# EAGLE design pcb-pick-plaz-ring (EAGLE 9.6.2)
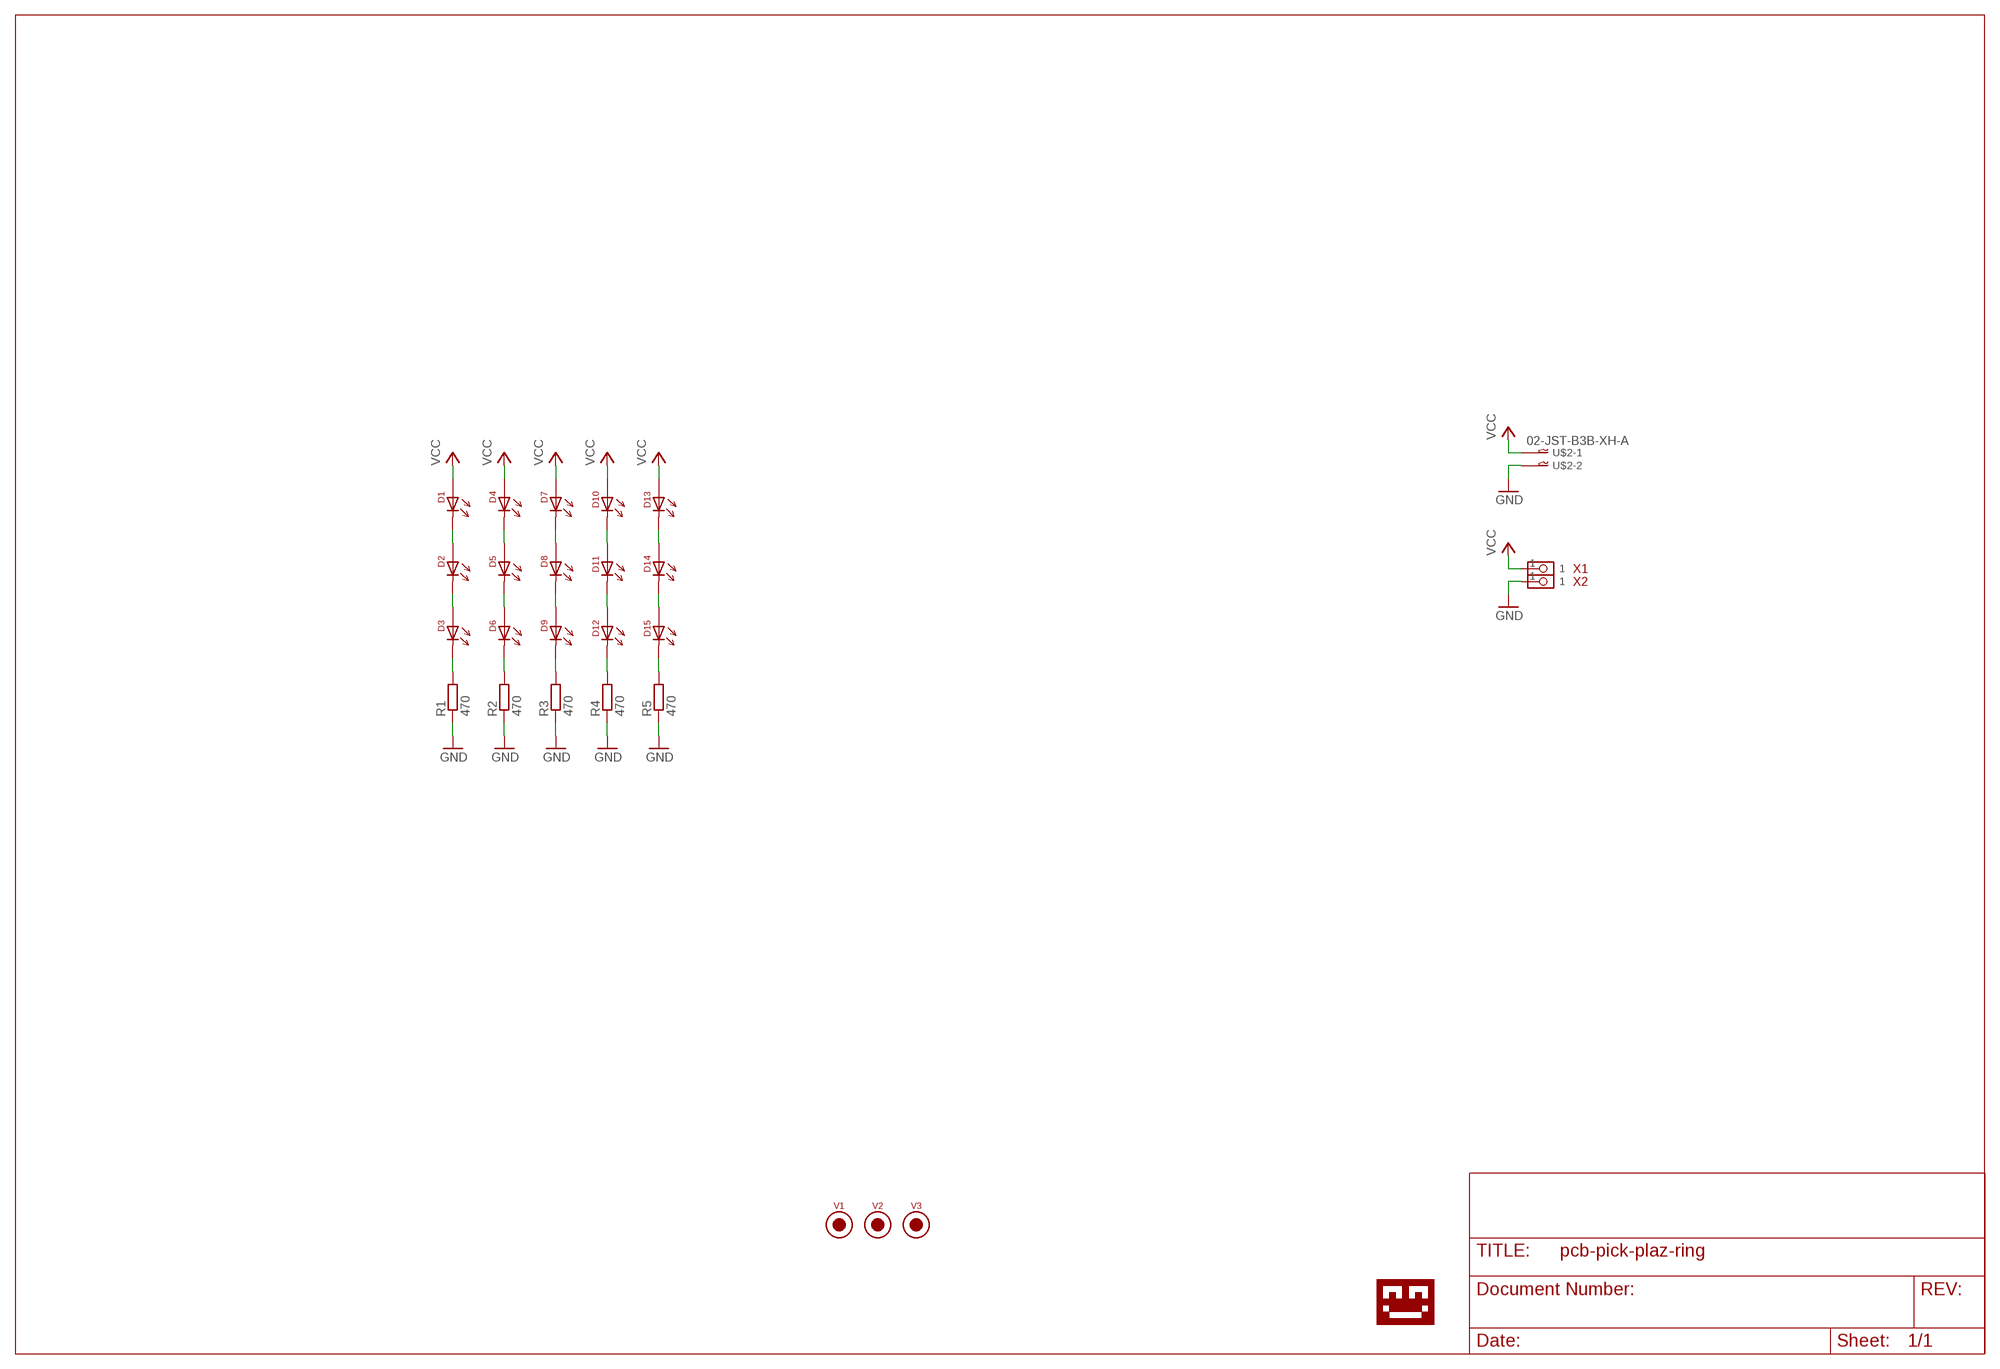
[diagram p0: schematic, sheet 1]

## Parts
D1  LED-5730  [5730-LED]
D2  LED-5730  [5730-LED]
D3  LED-5730  [5730-LED]
D4  LED-5730  [5730-LED]
D5  LED-5730  [5730-LED]
D6  LED-5730  [5730-LED]
D7  LED-5730  [5730-LED]
D8  LED-5730  [5730-LED]
D9  LED-5730  [5730-LED]
D10  LED-5730  [5730-LED]
D11  LED-5730  [5730-LED]
D12  LED-5730  [5730-LED]
D13  LED-5730  [5730-LED]
D14  LED-5730  [5730-LED]
D15  LED-5730  [5730-LED]
R1  470  RESISTOR0805_RES  [0805_RES]
R2  470  RESISTOR0805_RES  [0805_RES]
R3  470  RESISTOR0805_RES  [0805_RES]
R4  470  RESISTOR0805_RES  [0805_RES]
R5  470  RESISTOR0805_RES  [0805_RES]
U$1  LOGO-TOBENG-1MM-FINISH  [TOBENG-1MM-FINISH]
U$2  02-JST-B3B-XH-A  [B2B-XH]
V1  FIDUCIAL2MM  [FIDUCIAL_2MM]
V2  FIDUCIAL2MM  [FIDUCIAL_2MM]
V3  FIDUCIAL2MM  [FIDUCIAL_2MM]
X1  PIN_1X1SMD_BIG_L  [PIN_1X1_SMD_BIG_L]
X2  PIN_1X1SMD_BIG_L  [PIN_1X1_SMD_BIG_L]

## Nets
GND: R1.1 R2.1 R3.1 R4.1 R5.1 U$2.P$2 X2.1
N$1: D1.C D2.A1 D2.A2
N$2: D2.C D3.A1 D3.A2
N$3: D3.C R1.2
N$4: D4.C D5.A1 D5.A2
N$5: D5.C D6.A1 D6.A2
N$6: D6.C R2.2
N$7: D7.C D8.A1 D8.A2
N$8: D8.C D9.A1 D9.A2
N$9: D9.C R3.2
N$10: D10.C D11.A1 D11.A2
N$11: D11.C D12.A1 D12.A2
N$12: D12.C R4.2
N$13: D13.C D14.A1 D14.A2
N$14: D14.C D15.A1 D15.A2
N$15: D15.C R5.2
VCC: D1.A1 D1.A2 D4.A1 D4.A2 D7.A1 D7.A2 D10.A1 D10.A2 D13.A1 D13.A2 U$2.P$1 X1.1

## Library data of the parts
D1-D15 = ftobler:LED
R1-R5 = passives:RESISTOR: Resistor Basic schematic elements and footprints for 0201, 0402, 0603, 1206, and PTH resistors.
U$1 = ftobler:LOGO
U$2 = bt_con-jst-xh:02-JST: JST CONNECTOR
V1-V3 = ftobler:FIDUCIAL
X1 X2 = ftobler-conn:PIN_1X1

## Board
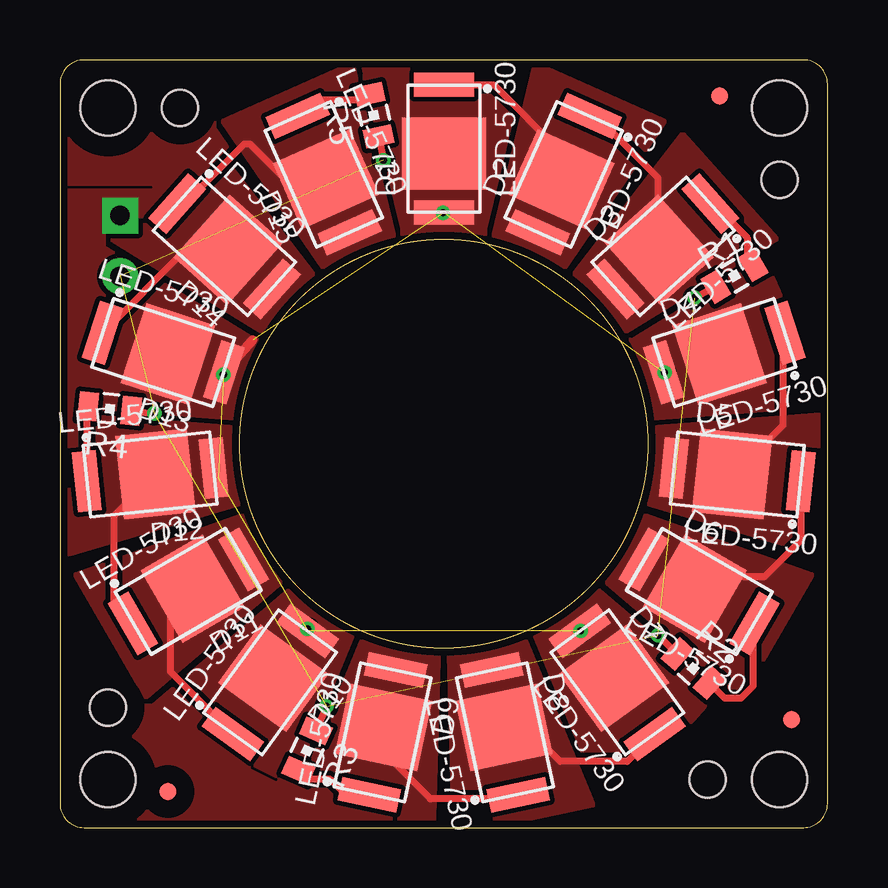
[diagram p1: board, top side]
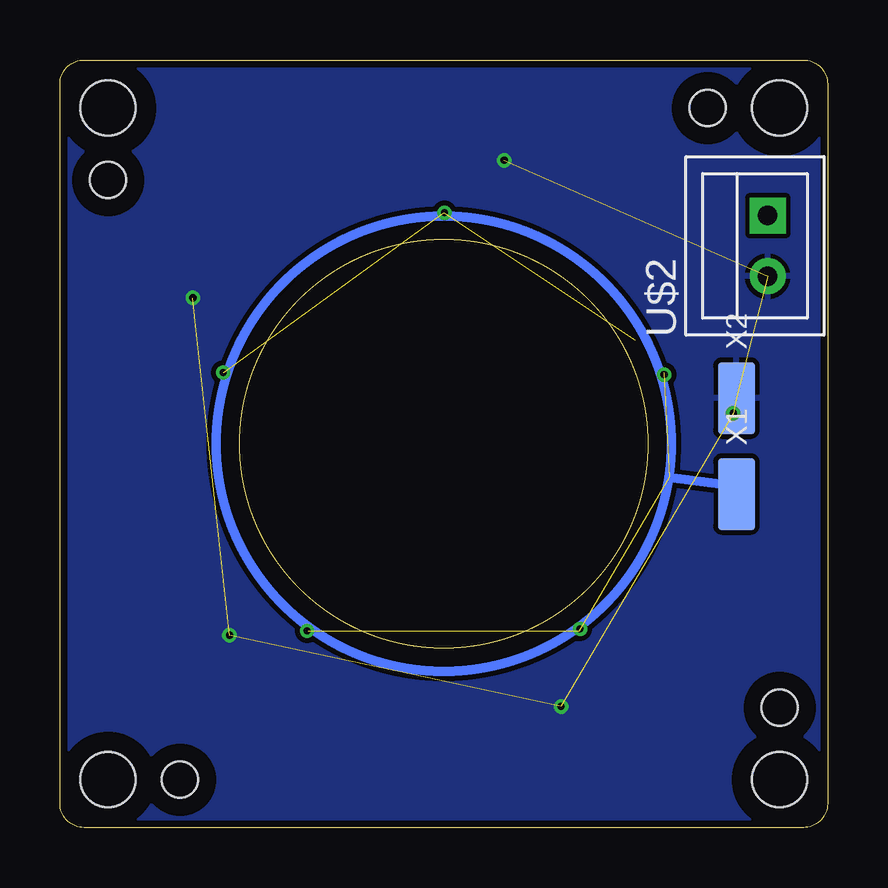
[diagram p2: board, bottom side, seen from below]

Size 32 x 32 mm. Coordinates in mm from the lower left corner, seen from the top.
Outline: 0,31 0,1 arc90 1,0 31,0 arc90 32,1 32,31 arc90 31,32 1,32 arc90 0,31
Outline: circle at 16,16 radius 8.5
Copper layers (1*16): Top 0.035mm / dielectric 1.5mm / Bottom 0.035mm
Design rules "default *": minimum track width 0.2mm, minimum drill 0.3mm, track to track 0.2mm, track to pad 0.2mm, pad to pad 0.2mm, via to via 0.2mm, smd to smd 0.2mm, copper to edge 0.3mm, drill to drill 10mil, minimum pad ring 0.15mm, minimum via ring 0.15mm, stop-mask expansion 0.05mm, vias tented up to drill 0.35mm, thermal gap 0.2mm
Holes 2.3 mm at 2,2 30,30 30,2 2,30
Holes 1.5 mm at 5,30 30,27 27,2 2,5
tRestrict: area 0,28 to 4,32; area 3.5,28.5 to 6.5,31.5; area 28.5,25.5 to 31.5,28.5; area 28,28 to 32,32; area 25.5,0.5 to 28.5,3.5; area 0.5,3.5 to 3.5,6.5; area 0,0 to 4,4; area 28,0 to 32,4; 4 lines
bRestrict: area 0,28 to 4,32; area 28,28 to 32,32; area 0,0 to 4,4; area 28,0 to 32,4; area 3.5,28.5 to 6.5,31.5; area 28.5,25.5 to 31.5,28.5; area 0.5,3.5 to 3.5,6.5; area 25.5,0.5 to 28.5,3.5

### Footprints (pad centres in the part's own frame; a part is rotated, then mirrored left to right if it is on the bottom)
5730-LED = smd 1 x 2.5: A1 -2.66,0; C 2.66,0 | smd 3 x 3.5: A2 -0.215,0
0805_RES = smd 0.8 x 1.2: 1 -0.9,0; 2 0.9,0
B2B-XH = drill 0.8 pad 1.5 square: P$1 1.27,0 | drill 0.8 pad 1.5: P$2 -1.27,0
FIDUCIAL_2MM = smd 0.7 x 0.7: V 0,0
PIN_1X1_SMD_BIG_L = smd 3 x 1.54: 1 0,0

### Placement (x,y rotation side)
D1  16,28.3 90 top
D2  21,27.24 66 top
D3  25.14,24.23 42 top
D4  27.7,19.8 18 top
D5  28.23,14.71 354 top
D6  26.65,9.85 330 top
D7  23.23,6.05 306 top
D8  18.56,3.97 282 top
D9  13.44,3.97 258 top
D10  8.77,6.05 234 top
D11  5.35,9.85 210 top
D12  3.77,14.71 186 top
D13  4.3,19.8 162 top
D14  6.86,24.23 138 top
D15  11,27.24 114 top
R1  28.12,23 30 top
R2  26.4,6.63 318 top
R3  10.31,3.21 246 top
R4  2.08,17.46 174 top
R5  13.09,29.69 102 top
U$1  24.1,27.7 0 bottom
U$2  2.5,24.25 90 bottom
V1  27.5,30.5 0 top
V2  30.5,4.5 0 top
V3  4.5,1.5 0 top
X1  3.8,13.9 90 bottom
X2  3.8,17.9 90 bottom

### Tracks (layer width: path | path; a pad name or v marks a point on that pad's centre or on a via)
GND  (via drill 0.3)  (6 unrouted)
  Top 0.3: R4.1 v3.93,17.27 | R5.1 v13.48,27.82 | R1.1 v26.46,22.08 | R2.1 v24.93,8.02 | R3.1 v11.11,5.05
  pour Bottom: 34,34 -1,34 -1,-1 34,-1
N$1
  Top 0.3: D1.C 18.09,30.96 20.91,28.13 D2.A2 | D2.A2
  pour Top (no thermals): 25.22,29.44 20.13,22.02 17.71,23.1 19.82,31.85
N$2
  Top 0.3: D2.C | D2.C 22.36,29.67 24.93,27.1 24.93,24.14 D3.A2 | D3.A2
  pour Top (no thermals): 29.89,24.53 22.22,19.82 20.62,21.6 20.6,21.98 25.94,28.92
N$3
  Top 0.3: D3.C 27.23,26.01 28.65,24.59 28.65,23.8 28.9,23.55 R1.2 | D3.C
N$4
  Top 0.3: D4.C 30.14,20.53 30.14,16.77 28.11,14.74 D5.A2 | D5.A2
  pour Top (no thermals): 31.63,11.39 23,13.93 23.28,16.56 32.25,17.26
N$5
  Top 0.3: D5.C 30.88,11.97 29.36,10.46 26.97,10.46 D6.A2
  pour Top (no thermals): 28.41,5.43 21.56,11.27 22.75,13.34 23.11,13.47 31.36,10.54
N$6
  Top 0.3: R2.2 27.7,5.4 28.4,5.4 28.9,5.9 28.9,8.46 D6.C
N$7
  Top 0.3: D7.C 23.65,2.76 20.85,2.76 19.43,4.18 D8.A2 | D7.C | D8.A2
  pour Top (no thermals): 16.45,-0.29 16.2,8.7 18.79,9.25 22.22,0.93
N$8
  Top 0.3: D8.C 18.94,1.2 15.44,1.2 13.49,3.15 D9.A2 | D9.A2
  pour Top (no thermals): 9.78,0.93 13.21,9.25 15.56,8.75 15.79,8.45 15.55,-0.29
N$9
  Top 0.3: R3.2 10.32,2.01 11.28,2.01 11.92,1.37 D9.C
N$10
  Top 0.3: D10.C 4.61,6.49 4.61,9.03 D11.A2 | D10.C
  pour Top (no thermals): 0.64,10.54 9.12,13.56 10.44,11.27 3.59,5.43
N$11
  Top 0.3: D11.C 2.25,9.31 2.25,13.01 D12.A2 | D11.C | D12.A2
  pour Top (no thermals): -0.25,17.26 8.72,16.56 8.97,14.18 8.76,13.86 0.37,11.39
N$12
  Top 0.3: R4.2 1.12,17.5 D12.C
N$13
  Top 0.3: D14.A2 5.24,24.09 D13.C
  pour Top (no thermals): 6.06,28.92 11.55,21.79 9.78,19.82 2.11,24.53
N$14
  Top 0.3: D15.A2 9.38,27.04 7.93,28.5 7.69,28.5 5.2,26.01 D14.C | D14.C
  pour Top (no thermals): 12.18,31.85 14.29,23.1 12.1,22.12 11.73,22.23 6.78,29.44
N$15
  Top 0.3: R5.2 12.66,30.32 10.57,30.32 D15.C | R5.2 | D15.C
N$16  (via drill 0.3)
  other vias: 15.97,25.63
N$17  (via drill 0.3)
  other vias: 25.2,18.97
N$18  (via drill 0.3)
  other vias: 21.7,8.2
N$19  (via drill 0.3)
  other vias: 10.32,8.28
N$20  (via drill 0.3)
  other vias: 6.81,18.88
VCC  (5 unrouted)
  Top 0.4: D13.A1 8.03,20.32
  Bottom 0.4: X1.1 4.19,14.29 6.6,14.6
  pour Top (rank 2, no thermals): 33,33 33,-2 -2,-2 -2,33
(copper drawn outside any net)
  shapes: Bottom circle x1

### Text on the board
bFinish: pcb-pick-plaz-ring v1b / by ftobler 2021 | JLCJLCJLCJLC